# EAGLE schematic 500Khz_TX (EAGLE 9.5.2)
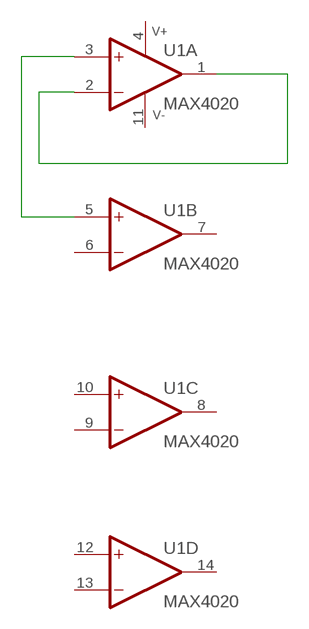
[diagram p0: schematic, sheet 1]

## Parts
U1  MAX4020  [SOIC127P600X144-14]

## Nets
N$1: U1.3(A:+IN) U1.5(B:+IN)
N$2: U1.1(A:OUT) U1.2(A:-IN)
Unconnected: U1.6(B:-IN) U1.7(B:OUT) U1.8(C:OUT) U1.9(C:-IN) U1.10(C:+IN) U1.12(D:+IN) U1.13(D:-IN) U1.14(D:OUT)

## Power pins joined to a net without a drawn wire
V+: U1.4(PWR:V+)
V-: U1.11(PWR:V-)

## Library data of the parts
U1 = myLibs:MAX4020